# Altium schematic sheet AU.SchDoc
size A3; SheetNumber: 23; SheetTotal: 35
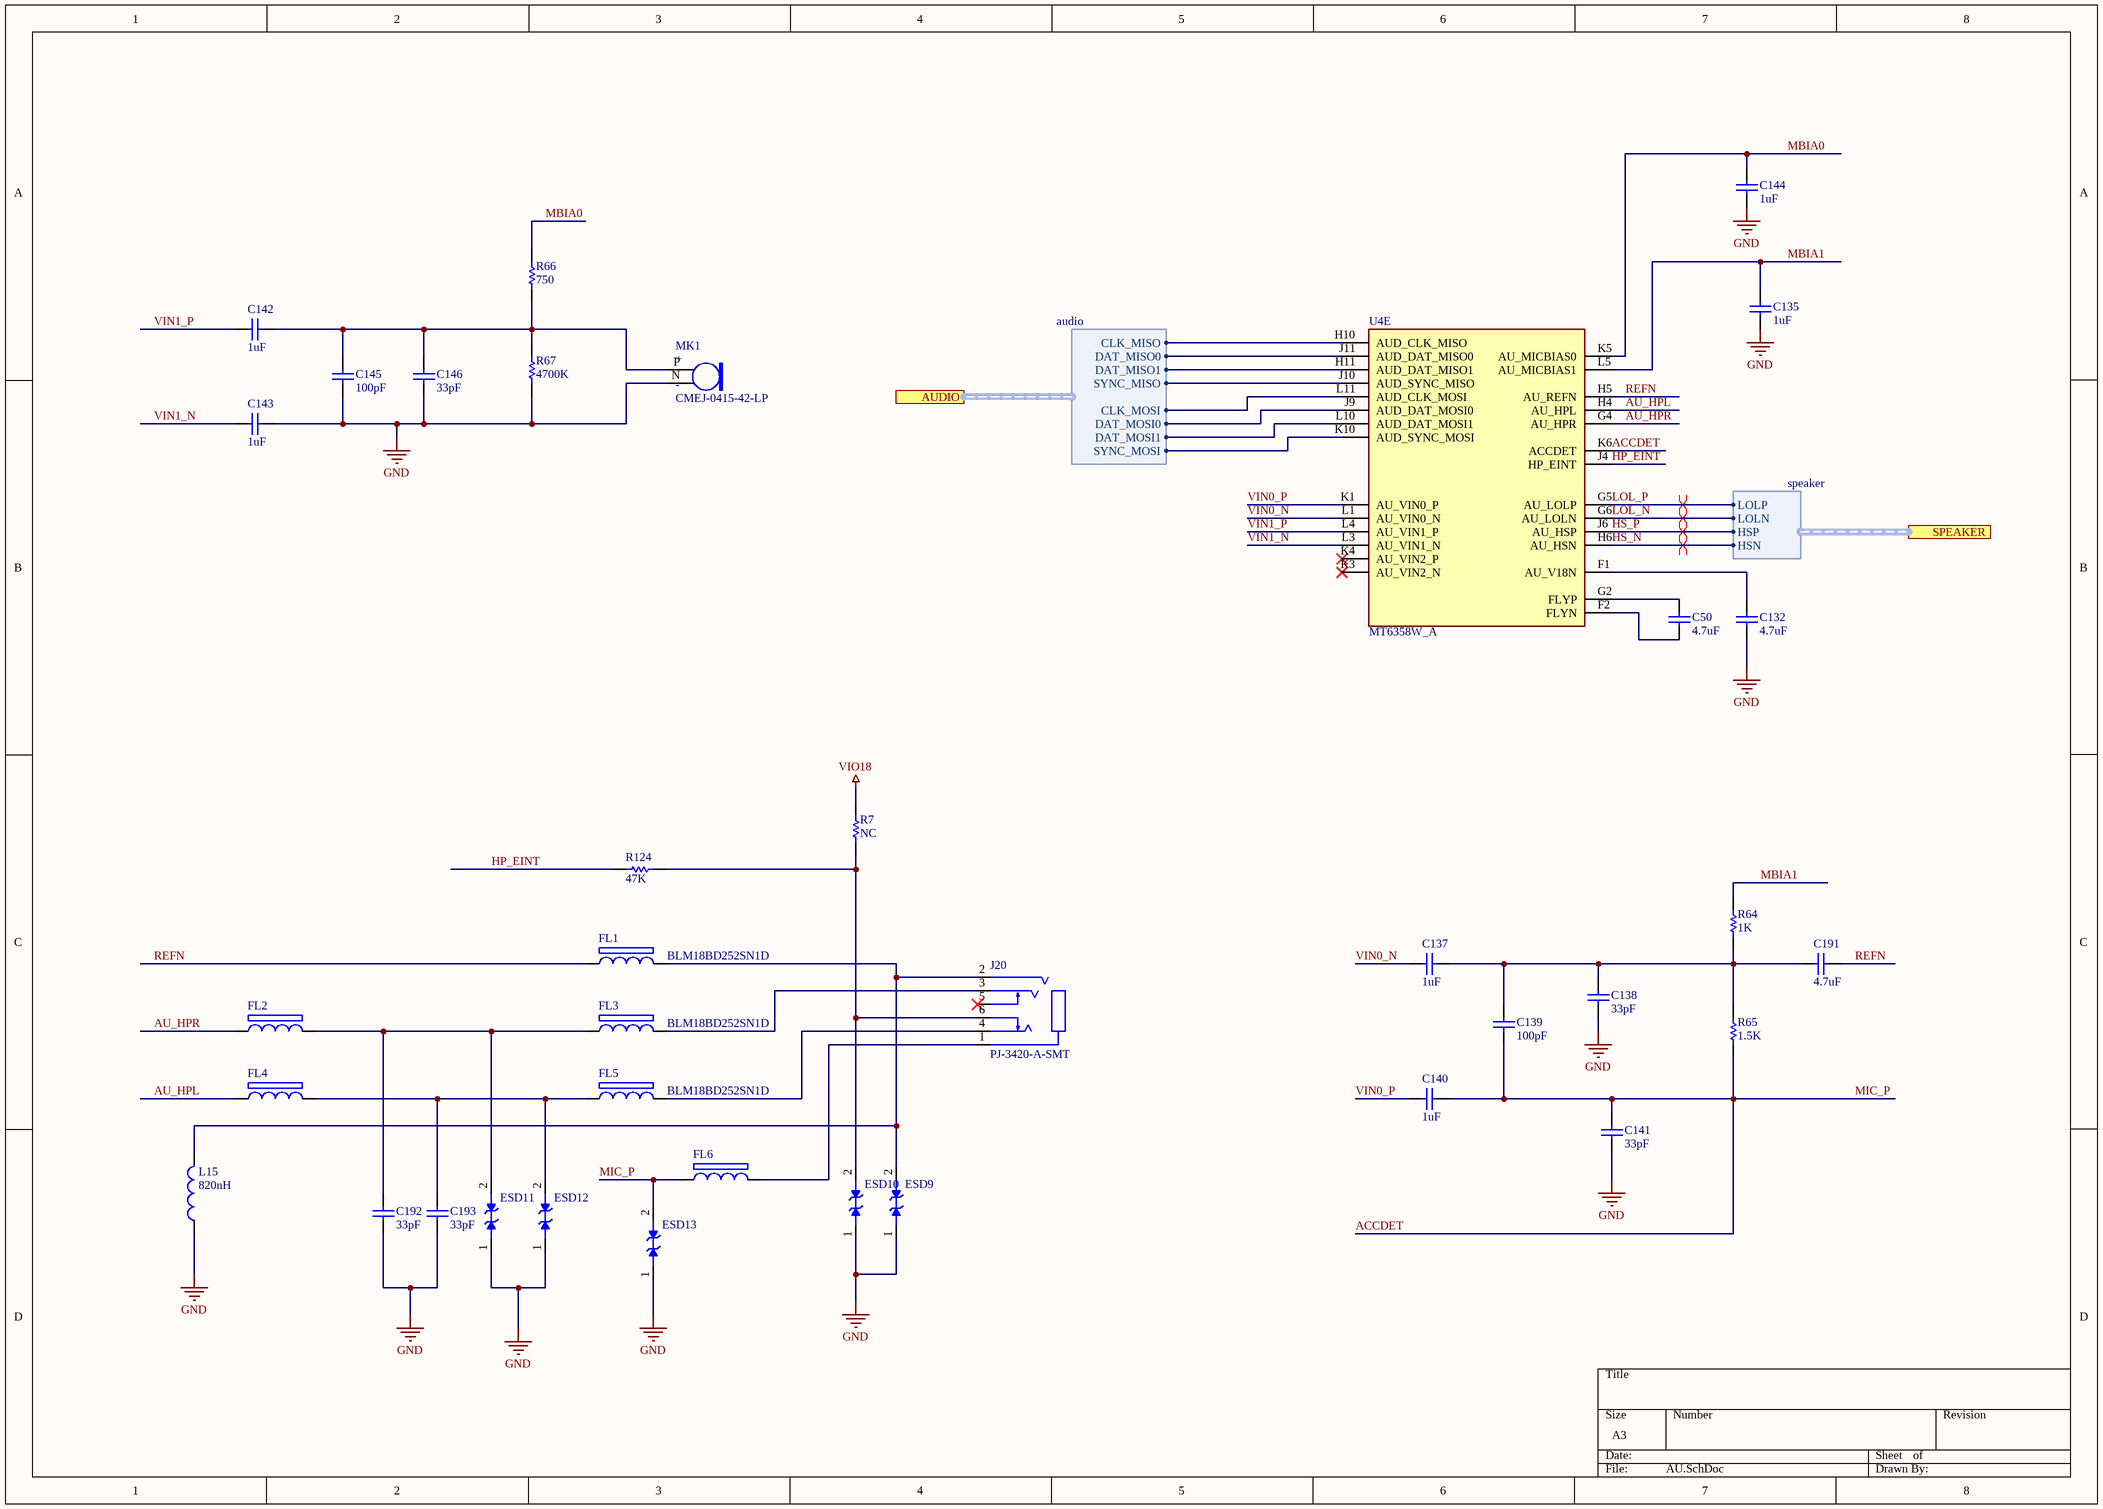
[diagram p0: AU.SchDoc]

## Parts
C50  value 4.7uF  [C0805]  (hidden comment: C0805)
C132  value 4.7uF  [C0805]  (hidden comment: C0805)
C135  value 1uF  [C0805]  (hidden comment: C0805)
C137  value 1uF  [C0805]  (hidden comment: C0805)
C138  value 33pF  [C0402]  (hidden comment: C0402)
C139  value 100pF  [C0402]  (hidden comment: C0402)
C140  value 1uF  [C0805]  (hidden comment: C0805)
C141  value 33pF  [C0402]  (hidden comment: C0402)
C142  value 1uF  [C0805]  (hidden comment: C0805)
C143  value 1uF  [C0805]  (hidden comment: C0805)
C144  value 1uF  [C0805]  (hidden comment: C0805)
C145  value 100pF  [C0402]  (hidden comment: C0402)
C146  value 33pF  [C0402]  (hidden comment: C0402)
C191  value 4.7uF  [C0805]  (hidden comment: C0805)
C192  value 33pF  [C0402]  (hidden comment: C0402)
C193  value 33pF  [C0402]  (hidden comment: C0402)
ESD9  ESD9B5.0ST5G  [SODFL1006X40N]  (value not drawn)
ESD10  ESD9B5.0ST5G  [SODFL1006X40N]  (value not drawn)
ESD11  ESD9B5.0ST5G  [SODFL1006X40N]  (value not drawn)
ESD12  ESD9B5.0ST5G  [SODFL1006X40N]  (value not drawn)
ESD13  ESD9B5.0ST5G  [SODFL1006X40N]  (value not drawn)
FL1  BLM18BD252SN1D  [BEADC1608X95N]
FL2  BLM18BD252SN1D  [BEADC1608X95N]  (value not drawn)
FL3  BLM18BD252SN1D  [BEADC1608X95N]
FL4  BLM18BD252SN1D  [BEADC1608X95N]  (value not drawn)
FL5  BLM18BD252SN1D  [BEADC1608X95N]
FL6  BLM18BD252SN1D  [BEADC1608X95N]  (value not drawn)
J20  PJ-3420-A-SMT  [PJ3420ASMT]
L15  value 820nH  [L0603]  (hidden comment: L0603)
MK1  CMEJ-0415-42-LP  [MIC_CMEJ-0415-42-LP]
R7  value NC  [R0603]  (hidden comment: R0603)
R64  value 1K  [R0603]  (hidden comment: R0603)
R65  value 1.5K  [R0603]  (hidden comment: R0603)
R66  value 750  [R0603]  (hidden comment: R0603)
R67  value 4700K  [R0603]  (hidden comment: R0603)
R124  value 47K  [R0603]  (hidden comment: R0603)
U4  MT6358W_A  [BGA194C40P16X15_640X600X66]  (part E of 6)

## Ports
AUDIO (harness audio, see Power[5400,5000], MT8365[10000,5800], MT8365_AUD[2500,6000], Power[5400,3900]), SPEAKER (harness speaker, see Power[5800,5000], AUDIO_AMP[397.796,3600], Power[5800,3800])

## Harnesses
audio: CLK_MISO, DAT_MISO0, DAT_MISO1, SYNC_MISO, CLK_MOSI, DAT_MOSI0, DAT_MOSI1, SYNC_MOSI
speaker: LOLP, LOLN, HSP, HSN

## Nets
GND: C132.2 C135.2 C138.1 C141.1 C143.1 C144.2 C145.1 C146.1 C192.1 C193.1 ESD9.1(A) ESD10.1(A) ESD11.1(A) ESD12.1(A) ESD13.1(A) L15.1 MK1.N(GND) R67.1
VIO18: R7.2
ACCDET: C139.1 C140.1 C141.2 ESD13.2(A1) FL6.1 R65.1 U4.K6(ACCDET)  [also labelled MIC_P]
AU_HPL: FL4.1 U4.H4(AU_HPL)
AU_HPR: FL2.1 U4.G4(AU_HPR)
HP_EINT: R124.1 U4.J4(HP_EINT)
HS_N: U4.H6(AU_HSN) ; port SPEAKER.HSN
HS_P: U4.J6(AU_HSP) ; port SPEAKER.HSP
LOL_N: U4.G6(AU_LOLN) ; port SPEAKER.LOLN
LOL_P: U4.G5(AU_LOLP) ; port SPEAKER.LOLP
MBIA0: C144.1 R66.2 U4.K5(AU_MICBIAS0)
MBIA1: C135.1 R64.2 U4.L5(AU_MICBIAS1)
REFN: C191.1 FL1.1 U4.H5(AU_REFN)
VIN0_N: C137.2 U4.L1(AU_VIN0_N)
VIN0_P: C140.2 U4.K1(AU_VIN0_P)
VIN1_N: C143.2 U4.L3(AU_VIN1_N)
VIN1_P: C142.2 U4.L4(AU_VIN1_P)
NetC50_1: C50.1 U4.G2(FLYP)
NetC50_2: C50.2 U4.F2(FLYN)
NetC132_1: C132.1 U4.F1(AU_V18N)
NetC137_1: C137.1 C138.2 C139.2 C191.2 R64.1 R65.2
NetC142_1: C142.1 C145.2 C146.2 MK1.P(OUTPUT) R66.1 R67.2
NetC192_2: C192.2 ESD11.2(A1) FL2.2 FL3.1
NetC193_2: C193.2 ESD12.2(A1) FL4.2 FL5.1
NetESD9_2: ESD9.2(A1) FL1.2 J20.2 L15.2
NetESD10_2: ESD10.2(A1) J20.6 R7.1 R124.2
NetFL3_2: FL3.2 J20.3
NetFL5_2: FL5.2 J20.4
NetFL6_2: FL6.2 J20.1
NetU4_H10: U4.H10(AUD_CLK_MISO) ; port AUDIO.CLK_MISO
NetU4_H11: U4.H11(AUD_DAT_MISO1) ; port AUDIO.DAT_MISO1
NetU4_J9: U4.J9(AUD_DAT_MOSI0) ; port AUDIO.DAT_MOSI0
NetU4_J10: U4.J10(AUD_SYNC_MISO) ; port AUDIO.SYNC_MISO
NetU4_J11: U4.J11(AUD_DAT_MISO0) ; port AUDIO.DAT_MISO0
NetU4_K10: U4.K10(AUD_SYNC_MOSI) ; port AUDIO.SYNC_MOSI
NetU4_L10: U4.L10(AUD_DAT_MOSI1) ; port AUDIO.DAT_MOSI1
NetU4_L11: U4.L11(AUD_CLK_MOSI) ; port AUDIO.CLK_MOSI

Not connected (* = marked no-connect by the designer): J20 5(4)*; U4 K3(AU_VIN2_N)* K4(AU_VIN2_P)*

## Layout directives
differential pair: HS_N, HS_P, LOL_N, LOL_P

## Notes on the sheet
- (in symbol CMEJ-0415-42-LP) +; -

## Library data of the parts
ESD9-ESD13 = ESD9B5.0ST5G: Clamp Ipp Tvs Diode Surface Mount SOD-923
FL1-FL6 = BLM18BD252SN1D: Inductor Chip Bead 2.5KOhm 25% 100MHz Ferrite 50mA 0603
J20 = PJ-3420-A-SMT: Connector; Manufacturer_Name: XKB Connectivity; Datasheet Link: http://www.helloxkb.com/public/images/pdf/PJ-3420-X-SMT.pdf; Height: 4.5mm; Manufacturer_Part_Number: PJ-3420-A-SMT
MK1 = CMEJ-0415-42-LP: 4.0 mm, Omnidirectional, PCB Mount, 2.0 Vdc, Elecret Condenser Microphone
U4 = MT6358W_A: PMIC; Manufacturer_Name: Mediatek; Manufacturer_Part_Number: MT6358W/A; Datasheet Link: https://www.mouser.com/catalog/specsheets/MediaTek_MTK_MT6358_Product_Brief_v1_0.pdf?_gl=1*14yevt7*_ga*OTAyMjU2NDU3LjE2ODExMDUyMzk.*_ga_1KQLCYKRX3*MTcwODA1NjU3MS4xMTcuMC4xNzA4MDU2NTczLjAuMC4w*_ga_15W4STQT4T*MTcwODA1NjU3Mi4xNzIuMC4xNzA4MDU2NTczLjU5LjAuMA..; Height: 0.66mm; Mouser Part Number: 840-MT6358W/A; Mouser Price/Stock: https://www.mouser.co.uk/ProductDetail/MediaTek/MT6358W-A?qs=Jm2GQyTW%2FbiK3FZkyfX0lQ%3D%3D